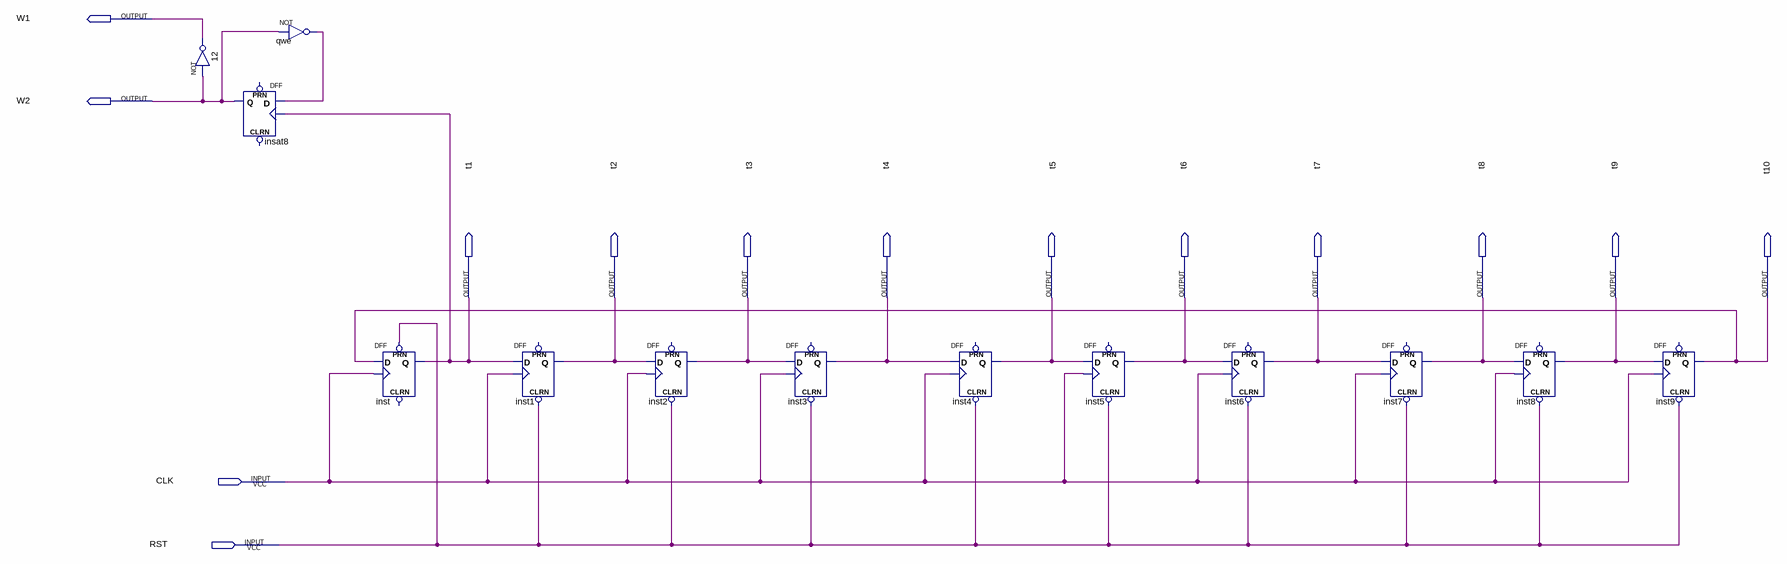
[diagram p0: schematic sheet]
// Quartus schematic pcp.bdf as structural Verilog: 13 symbols, 14 pins
module pcp (
  input  CLK,
  input  RST,
  output W1,
  output W2,
  output t1,
  output t2,
  output t3,
  output t4,
  output t5,
  output t6,
  output t7,
  output t8,
  output t9,
  output t10
);

  wire qwe_out;

  not u_12 (W1, W2);
  DFF insat8 (.CLK(t1), .D(qwe_out), .Q(W2));  // open: CLRN, PRN
  not qwe (qwe_out, W2);
  DFF inst (.CLK(CLK), .D(t10), .PRN(RST), .Q(t1));  // open: CLRN
  DFF inst1 (.CLRN(RST), .CLK(CLK), .D(t1), .Q(t2));  // open: PRN
  DFF inst2 (.CLRN(RST), .CLK(CLK), .D(t2), .Q(t3));  // open: PRN
  DFF inst3 (.CLRN(RST), .CLK(CLK), .D(t3), .Q(t4));  // open: PRN
  DFF inst4 (.CLRN(RST), .CLK(CLK), .D(t4), .Q(t5));  // open: PRN
  DFF inst5 (.CLRN(RST), .CLK(CLK), .D(t5), .Q(t6));  // open: PRN
  DFF inst6 (.CLRN(RST), .CLK(CLK), .D(t6), .Q(t7));  // open: PRN
  DFF inst7 (.CLRN(RST), .CLK(CLK), .D(t7), .Q(t8));  // open: PRN
  DFF inst8 (.CLRN(RST), .CLK(CLK), .D(t8), .Q(t9));  // open: PRN
  DFF inst9 (.CLRN(RST), .CLK(CLK), .D(t9), .Q(t10));  // open: PRN
endmodule
